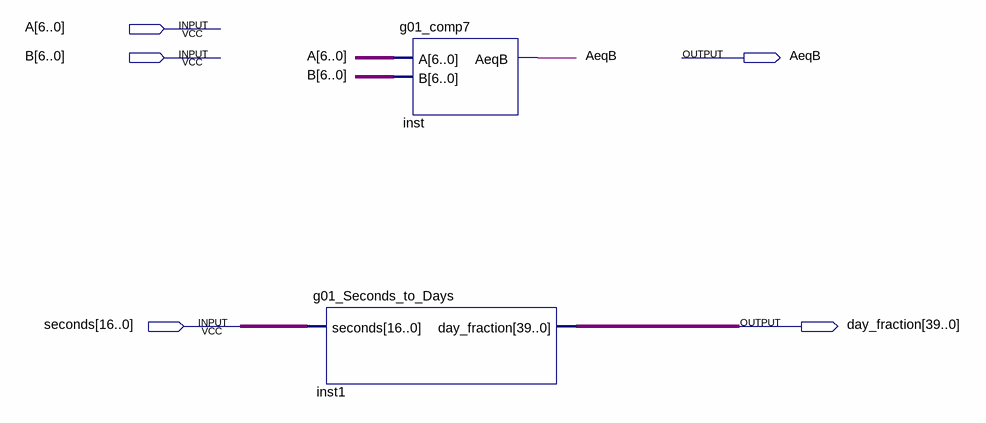
[diagram p0: schematic sheet]
// Quartus schematic g01_lab1.bdf as structural Verilog: 2 symbols, 5 pins
module g01_lab1 (
  input  [6:0] A,
  input  [6:0] B,
  input  [16:0] seconds,
  output AeqB,
  output [39:0] day_fraction
);

  g01_Seconds_to_Days inst1 (.seconds(seconds), .day_fraction(day_fraction));
  g01_comp7 inst (.A(A), .B(B), .AeqB(AeqB));
endmodule
